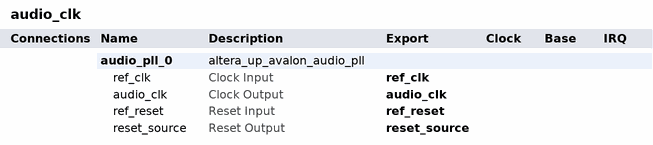
[diagram p0: system contents]
# Platform Designer (Qsys) system audio_clk, Cyclone V 5CSEMA5F31C6
# Parameters at their usual value, and those the tool derives, are not listed.
package require -exact qsys 18.0
create_system audio_clk
set_project_property DEVICE_FAMILY {Cyclone V}
set_project_property DEVICE 5CSEMA5F31C6

add_instance audio_pll_0 altera_up_avalon_audio_pll 18.0
set_instance_property audio_pll_0 AUTO_EXPORT true
set_instance_parameter_value audio_pll_0 audio_clk_freq 18.432
set_instance_parameter_value audio_pll_0 gui_refclk 50.0

# exported interfaces
add_interface audio_clk clock source
set_interface_property audio_clk EXPORT_OF audio_pll_0.audio_clk
add_interface ref_clk clock sink
set_interface_property ref_clk EXPORT_OF audio_pll_0.ref_clk
add_interface ref_reset reset sink
set_interface_property ref_reset EXPORT_OF audio_pll_0.ref_reset
add_interface reset_source reset source
set_interface_property reset_source EXPORT_OF audio_pll_0.reset_source

set_interconnect_requirement {$system} qsys_mm.clockCrossingAdapter HANDSHAKE
set_interconnect_requirement {$system} qsys_mm.enableEccProtection FALSE
set_interconnect_requirement {$system} qsys_mm.insertDefaultSlave FALSE
set_interconnect_requirement {$system} qsys_mm.maxAdditionalLatency 1

save_system audio_clk.qsys
